# Altium schematic sheet power.SchDoc: Power Supplies
size Tabloid; CheckedBy: J. Brinton; CompanyName: Signal Laboratories, Inc.; DrawnBy: J. Brinton; Engineer: J. Brinton; Address1: 3479 Edison Way; Address2: Menlo Park CA 94025; Address3: +1 (877) 778-8435; Address4: siglabs.com; DocumentNumber: 7; Revision: 1; SheetNumber: 7; SheetTotal: 58
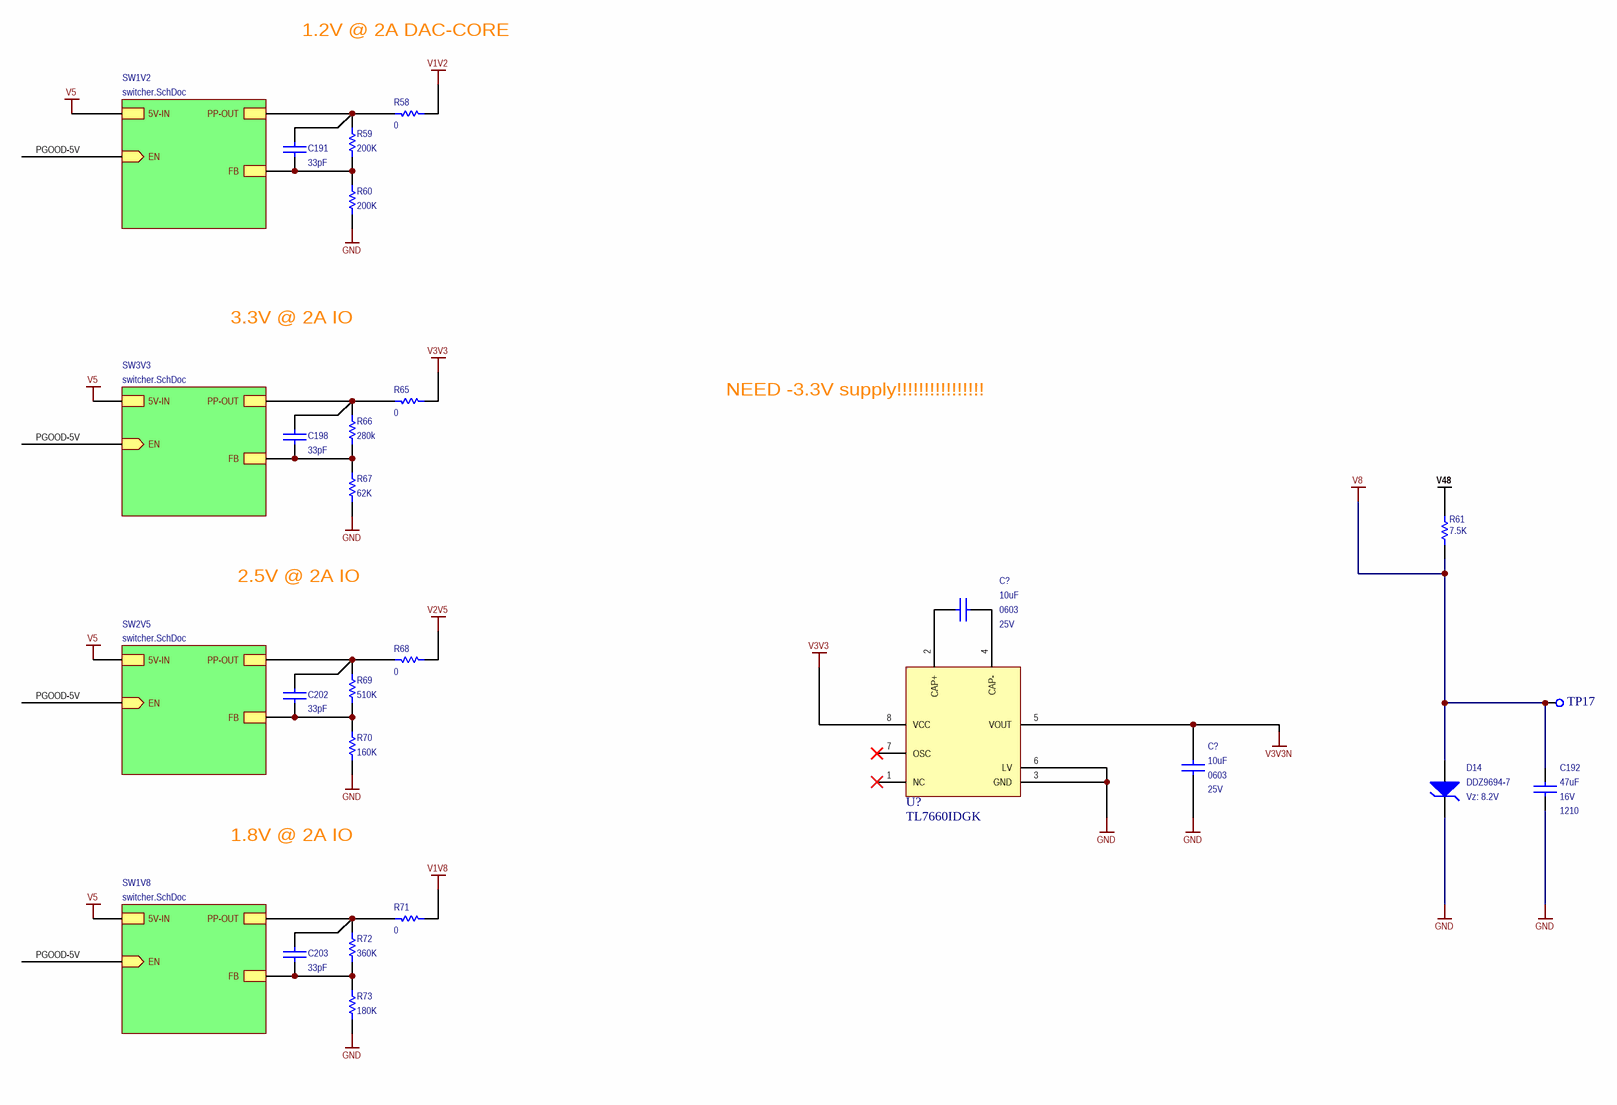
[diagram p0: power.SchDoc]

## Parts
(Parts that share a designator on the sheet are numbered #1, #2 ... from top to bottom, then left to right.)
C191  value 33pF  [CAPC100X50X55L25N]  (hidden comment: GRM1555C1H330JA01D)
C192  value 47uF  Voltage: 16V  [1210]  (hidden comment: GRM32EC81C476KE15L)
C198  value 33pF  [CAPC100X50X55L25N]  (hidden comment: GRM1555C1H330JA01D)
C202  value 33pF  [CAPC100X50X55L25N]  (hidden comment: GRM1555C1H330JA01D)
C203  value 33pF  [CAPC100X50X55L25N]  (hidden comment: GRM1555C1H330JA01D)
C?#1  value 10uF  Voltage: 25V  [0603]  (hidden comment: CL10A106MA8NRNC)
C?#2  value 10uF  Voltage: 25V  [0603]  (hidden comment: CL10A106MA8NRNC)
D14  DDZ9694-7  Vz: 8.2V  [SOD123]
R58  value 0  [0805]  (hidden comment: ERJ-6GEY0R00V)
R59  value 200K  [RESC1005X40N]  (hidden comment: ERJ-2RKF2003X)
R60  value 200K  [RESC1005X40N]  (hidden comment: ERJ-2RKF2003X)
R61  value 7.5K  [RESC3216X63L44N]  (hidden comment: HRG3216P-7501-D-T1)
R65  value 0  [0805]  (hidden comment: ERJ-6GEY0R00V)
R66  value 280k  [0402]  (hidden comment: ERJ-2RKF2803X)
R67  value 62K  [0402]  (hidden comment: ERJ-2RKF6202X)
R68  value 0  [0805]  (hidden comment: ERJ-6GEY0R00V)
R69  value 510K  [RESC1005X40N]  (hidden comment: ERJ-2RKF5103X)
R70  value 160K  [RESC1005X40N]  (hidden comment: ERJ-2RKF1603X)
R71  value 0  [0805]  (hidden comment: ERJ-6GEY0R00V)
R72  value 360K  [RESC1005X40N]  (hidden comment: RC0402FR-07360KL)
R73  value 180K  [RESC1005X40N]  (hidden comment: RC0402FR-07180KL)
TP17  TEST_POINT_SMD_10  [TEST_POINT_SMD_10]  (value not drawn)  (no BOM)
U?  TL7660IDGK  [SOP8P65_300X490X110L60X30N]

## Sub-sheets
SW1V2 = switcher.SchDoc: 5V-IN, PP-OUT, EN (in), FB
SW1V8 = switcher.SchDoc: 5V-IN, PP-OUT, EN (in), FB
SW2V5 = switcher.SchDoc: 5V-IN, PP-OUT, EN (in), FB
SW3V3 = switcher.SchDoc: 5V-IN, PP-OUT, EN (in), FB

## Nets
GND: C192.1 C?#2.2 D14.2(C) R60.1 R67.1 R70.1 R73.1 U?.3(GND) U?.6(LV)
V1V2: R58.2
V1V8: R71.2
V2V5: R68.2
V3V3: R65.2 U?.8(VCC)
V3V3N: C?#2.1 U?.5(VOUT)
V5: sheet SW1V2/5V-IN, sheet SW1V8/5V-IN, sheet SW3V3/5V-IN, sheet SW2V5/5V-IN
V8: C192.2 D14.1(A) R61.2 TP17.1
V48: R61.1
PGOOD-5V: sheet SW1V2/EN, sheet SW1V8/EN, sheet SW3V3/EN, sheet SW2V5/EN
NetC191_1: C191.1 R59.1 R60.2 ; sheet SW1V2/FB
NetC191_2: C191.2 R58.1 R59.2 ; sheet SW1V2/PP-OUT
NetC198_1: C198.1 R66.1 R67.2 ; sheet SW3V3/FB
NetC198_2: C198.2 R65.1 R66.2 ; sheet SW3V3/PP-OUT
NetC202_1: C202.1 R69.1 R70.2 ; sheet SW2V5/FB
NetC202_2: C202.2 R68.1 R69.2 ; sheet SW2V5/PP-OUT
NetC203_1: C203.1 R72.1 R73.2 ; sheet SW1V8/FB
NetC203_2: C203.2 R71.1 R72.2 ; sheet SW1V8/PP-OUT
NetC?#1_1: C?#1.1 U?.2(CAP+)
NetC?#1_2: C?#1.2 U?.4(CAP-)

Not connected (* = marked no-connect by the designer): U? 1(NC)* 7(OSC)*

## Notes on the sheet
- 1.2V @ 2A DAC-CORE
- 3.3V @ 2A IO
- NEED -3.3V supply!!!!!!!!!!!!!!!!
- 2.5V @ 2A IO
- 1.8V @ 2A IO
- Title
- Engineer
- Revision
- Drawn By
- Checked By
- Date
- Sheet
- of

## Library data of the parts
C191 C198 C202 C203 = CC0402JRNPO9BN330: Ceramic Capacitor 33pF ±5% 50V NP0 0402; Manufacturer: Murata; Tr: -55:125; Manufacturer P/N: GRM1555C1H330JA01D; Tolerance: ±5%; Voltage: 50V; Footprint: 0402; Package: 0402
C192 = CAP: Ceramic Capacitor 47uF ±10% 16V X6S 1210; Manufacturer: Murata; Tr: -55:105; Manufacturer P/N: GRM32EC81C476KE15L; Tolerance: ±10%; Footprint: *; Package: 1210
C?#1 C?#2 = CAP 0603: Ceramic Capacitor 10uF ±20% 25V X5R 0603; Manufacturer: Samsung; Tr: -55:85; Manufacturer P/N: CL10A106MA8NRNC; Package: 0603; Tolerance: ±20%
D14 = DDZ9694-7: Zener Diode 8.2V 500mW SOD123; Manufacturer: Diodes, Inc.; Manufacturer P/N: DDZ9694-7
R58 R65 R68 R71 = RES 0805: Thick Film Resistor Jumper 0805; Manufacturer: Panasonic; Tr: -55:155; Package: 0805; Manufacturer P/N: ERJ-6GEY0R00V; Tolerance: 0
  R58 R68 R71: Do Not Place: *
R59 R60 = RES 0402: Thick Film Resistor 200k ±1% 0402; Manufacturer: Panasonic; Tr: -55:155; Manufacturer P/N: ERJ-2RKF2003X; Package: 0402; Do Not Place: *; Tolerance: ±1%
R61 = RES 0402: Thick Film 7.5k ±0.5% 1W 1206; Manufacturer: Susumu; Tr: -55:155; Package: 1206; Manufacturer P/N: HRG3216P-7501-D-T1; Tolerance: ±0.5%
R66 = RES 0402 100k +/-0.5% +/-25TCR: Thick Film 280k ±1% 0402; Manufacturer: Panasonic; Tr: -55:155; Tolerance: ±1%; Manufacturer P/N: ERJ-2RKF2803X; Package: 0402
R67 = RES 0402 100k +/-0.5% +/-25TCR: Thick Film Resistor 62k ±1% 0402; Manufacturer: Panasonic; Tr: -55:155; Tolerance: ±1%; Manufacturer P/N: ERJ-2RKF6202X; Package: 0402
R69 = RES 0402: Thick Film Resistor 510k ±1% 0402; Manufacturer: Panasonic; Tr: -55:155; Manufacturer P/N: ERJ-2RKF5103X; Package: 0402; Do Not Place: *; Tolerance: ±1%
R70 = RES 0402: Thick Film Resistor 160k ±1% 0402; Manufacturer: Panasonic; Tr: -55:155; Manufacturer P/N: ERJ-2RKF1603X; Package: 0402; Do Not Place: *; Tolerance: ±1%
R72 = RES 0402: Thick Film Resistor 360k ±1% 0402; Manufacturer: Yageo; Tr: -55:155; Manufacturer P/N: RC0402FR-07360KL; Package: 0402; Do Not Place: *; Tolerance: ±1%
R73 = RES 0402: Thick Film Resistor 180k ±1% 0402; Manufacturer: Yageo; Tr: -55:155; Manufacturer P/N: RC0402FR-07180KL; Package: 0402; Do Not Place: *; Tolerance: ±1%
TP17 = TEST_POINT_SMD_10: Test Point SMD
U? = TL7660IDGK: CMOS Voltage Converter; Manufacturer: Texas Instruments; Manufacturer P/N: TL7660IDGK